# EAGLE design lightbar (EAGLE 5.04)
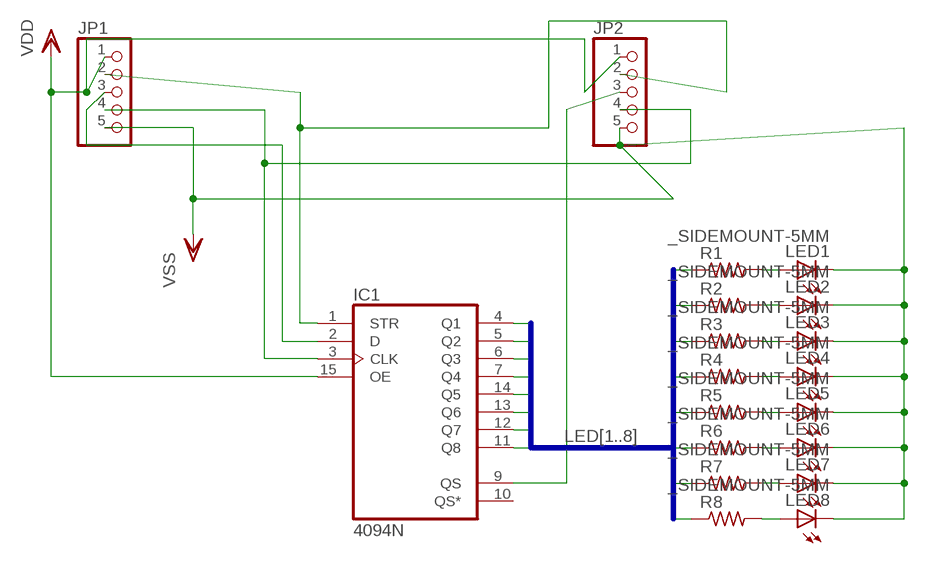
[diagram p0: schematic, sheet 1]

## Parts
IC1  4094N  [DIL16]
JP1  PINHD-1X5  [1X05]
JP2  PINHD-1X5  [1X05]
LED1  _SIDEMOUNT-5MM  [LED5MMSIDEMOUNT]
LED2  _SIDEMOUNT-5MM  [LED5MMSIDEMOUNT]
LED3  _SIDEMOUNT-5MM  [LED5MMSIDEMOUNT]
LED4  _SIDEMOUNT-5MM  [LED5MMSIDEMOUNT]
LED5  _SIDEMOUNT-5MM  [LED5MMSIDEMOUNT]
LED6  _SIDEMOUNT-5MM  [LED5MMSIDEMOUNT]
LED7  _SIDEMOUNT-5MM  [LED5MMSIDEMOUNT]
LED8  _SIDEMOUNT-5MM  [LED5MMSIDEMOUNT]
R1  R-US_0207/7  [0207/7]
R2  R-US_0207/7  [0207/7]
R3  R-US_0207/7  [0207/7]
R4  R-US_0207/7  [0207/7]
R5  R-US_0207/7  [0207/7]
R6  R-US_0207/7  [0207/7]
R7  R-US_0207/7  [0207/7]
R8  R-US_0207/7  [0207/7]

## Nets
LED1: IC1.4(Q1) R1.1
LED2: IC1.5(Q2) R2.1
LED3: IC1.6(Q3) R3.1
LED4: IC1.7(Q4) R4.1
LED5: IC1.14(Q5) R5.1
LED6: IC1.13(Q6) R6.1
LED7: IC1.12(Q7) R7.1
LED8: IC1.11(Q8) R8.1
N$1: IC1.2(D) JP1.3
N$2: IC1.9(QS) JP2.3
N$3: IC1.3(CLK) JP1.4 JP2.4
N$4: IC1.1(STR) JP1.2 JP2.2
N$8: LED1.A R1.2
N$9: LED2.A R2.2
N$10: LED3.A R3.2
N$11: LED4.A R4.2
N$12: LED5.A R5.2
N$13: LED6.A R6.2
N$14: LED7.A R7.2
N$15: LED8.A R8.2
VDD: IC1.15(OE) JP1.1
VSS: JP1.5 JP2.5 LED1.K(C) LED2.K(C) LED3.K(C) LED4.K(C) LED5.K(C) LED6.K(C) LED7.K(C) LED8.K(C)
Unconnected: IC1.10(QS*) JP2.1

## Buses
LED[1..8]

## Power pins joined to a net without a drawn wire
VDD: IC1.16(VDD)
VSS: IC1.8(VSS)

## Library data of the parts
IC1 = 40xx:4094: 8-stage SHIFT/STORE REGISTER, tri-state
JP1 JP2 = pinhead:PINHD-1X5: PIN HEADER
LED1-LED8 = led:_SIDEMOUNT-5MM
R1-R8 = resistor:R-US_: RESISTOR, American symbol

## Board
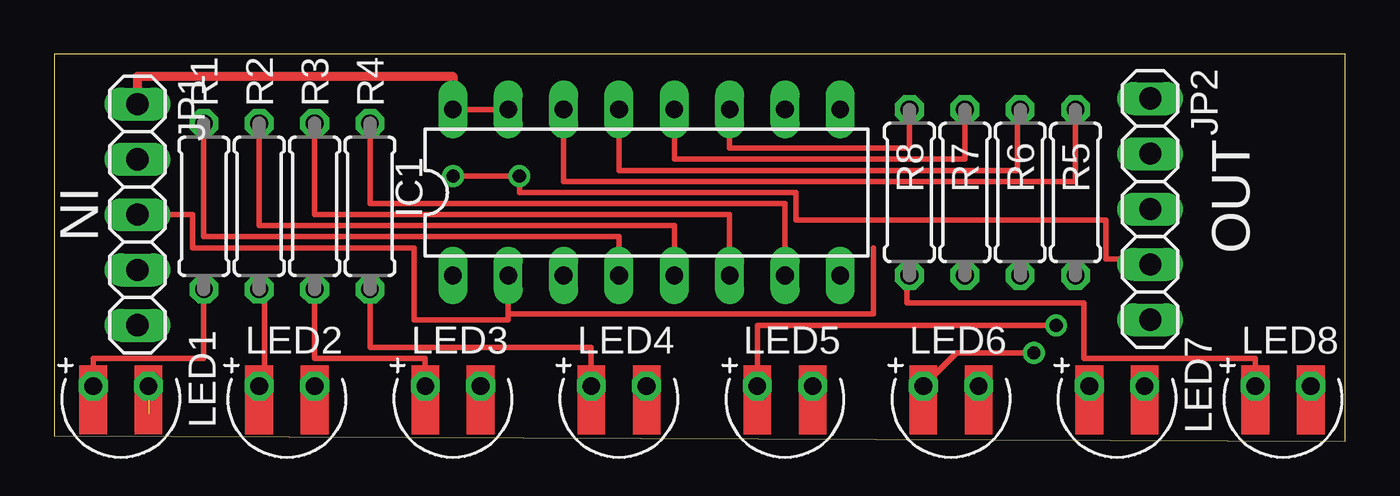
[diagram p1: board, top side]
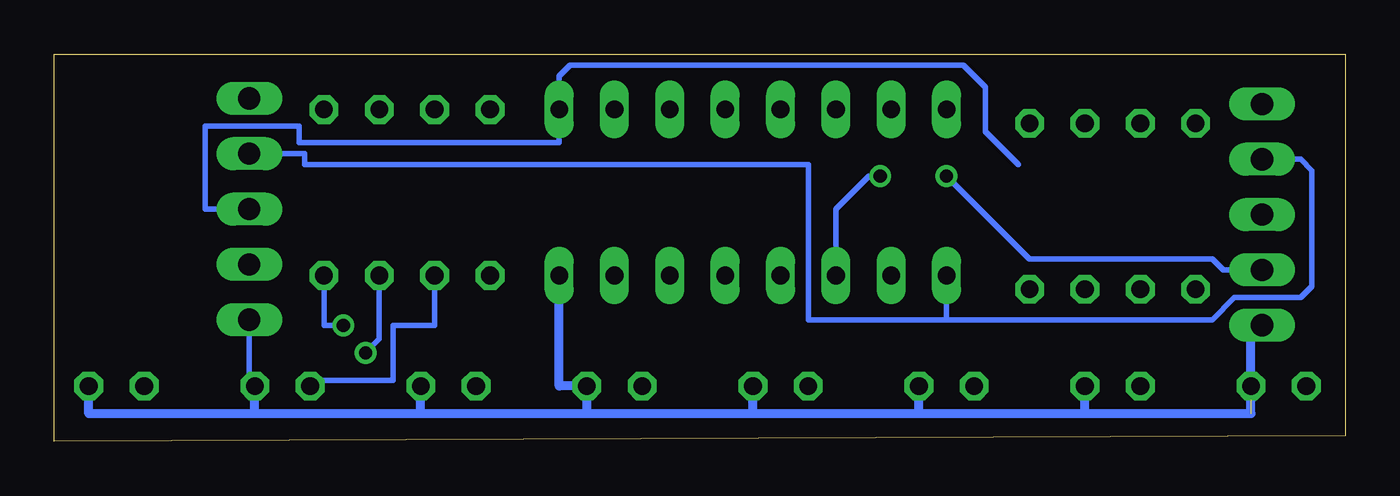
[diagram p2: board, bottom side, seen from below]

Size 59.23 x 17.77 mm. Coordinates in mm from the lower left corner, seen from the top.
Outline: 0,0.25 59.23,0 59.23,17.77 0,17.77 0,0.25
Copper layers (1*16): Top 0.035mm / dielectric 1.5mm / Bottom 0.035mm
Design rules "default *": minimum track width 10mil, minimum drill 24mil, track to track 8mil, track to pad 8mil, pad to pad 8mil, via to via 8mil, smd to smd 8mil, copper to edge 40mil, drill to drill 8mil, minimum pad ring 10mil, minimum via ring 8mil, stop-mask expansion 4mil, vias tented up to drill 24mil, thermal gap 10mil

### Footprints (pad centres in the part's own frame; a part is rotated, then mirrored left to right if it is on the bottom)
DIL16 = drill 0.813 long: 1 -8.89,-3.81; 2 -6.35,-3.81; 3 -3.81,-3.81; 4 -1.27,-3.81; 5 1.27,-3.81; 6 3.81,-3.81; 7 6.35,-3.81; 8 8.89,-3.81; 9 8.89,3.81; 10 6.35,3.81; 11 3.81,3.81; 12 1.27,3.81; 13 -1.27,3.81; 14 -3.81,3.81; 15 -6.35,3.81; 16 -8.89,3.81
1X05 = drill 1.016 long: 1 -5.08,0; 2 -2.54,0; 3 0,0; 4 2.54,0; 5 5.08,0
LED5MMSIDEMOUNT = drill 0.813 octagon: A -1.27,0; K 1.27,0
0207/7 = drill 0.813 octagon: 1 -3.81,0; 2 3.81,0

### Placement (x,y rotation side)
IC1  27.18,11.43 0 top
JP1  3.81,10.41 270 top
JP2  50.29,10.67 270 top
LED1  3.05,2.54 0 top
LED2  10.67,2.54 0 top
LED3  18.29,2.54 0 top
LED4  25.91,2.54 0 top
LED5  33.53,2.54 0 top
LED6  41.15,2.54 0 top
LED7  48.77,2.54 0 top
LED8  56.39,2.54 0 top
R1  6.86,10.79 270 top
R2  9.4,10.79 270 top
R3  11.94,10.79 270 top
R4  14.48,10.79 270 top
R5  46.86,11.43 270 top
R6  44.32,11.43 270 top
R7  41.78,11.43 270 top
R8  39.24,11.43 270 top

### Tracks (layer width: path | path; a pad name or v marks a point on that pad's centre or on a via)
LED1
  Top 0.254: R1.1 6.86,9.4 25.91,9.4 IC1.4
LED2
  Top 0.254: R2.1 9.4,9.91 28.45,9.91 IC1.5
LED3
  Top 0.254: R3.1 11.94,10.41 30.99,10.41 IC1.6
LED4
  Top 0.254: IC1.7 33.53,10.92 14.48,10.92 R4.1
LED5
  Top 0.254: R5.1 46.86,11.94 23.37,11.94 IC1.14
LED6
  Top 0.254: IC1.13 25.91,12.45 44.2,12.45 44.2,15.24 R6.1
LED7
  Top 0.254: R7.1 41.78,12.95 28.45,12.95 IC1.12
LED8
  Top 0.254: R8.1 39.24,13.46 30.99,13.46 IC1.11
N$1
  Top 0.254: 37.59,8.89 37.59,5.84 20.83,5.84 | 20.83,5.84 IC1.2 | JP1.3 6.35,10.41 6.35,8.89 16.51,8.89 16.51,5.59 20.83,5.59 20.83,5.84
N$2
  Bottom 0.254: 14.99,12.7 16.51,14.22 16.51,16.26 17.53,17.27 35.56,17.27 36.07,16.76 IC1.9 36.07,13.72 48.01,13.72 48.01,14.48 52.32,14.48 52.32,10.67 JP2.3
N$3  (via drill 0.6)
  Top 0.254: v18.29,12.19 v21.34,12.19 21.34,11.43 34.04,11.43 34.04,10.16 48.26,10.16 48.26,8.38 50.29,8.38 JP2.4
  Bottom 0.254: 16.64,10.54 16.26,10.16 | 16.64,10.54 v18.29,12.19 | v21.34,12.19 21.84,12.19 23.37,10.67 IC1.3 | JP1.4 5.59,7.87 6.1,8.38 14.48,8.38 16.64,10.54
N$4
  Bottom 0.254: 18.29,5.59 6.1,5.59 5.08,6.6 2.03,6.6 1.52,7.11 1.52,12.45 2.03,12.95 JP1.2 | 18.29,5.59 24.64,5.59 24.64,12.7 47.75,12.7 47.75,13.21 JP2.2 | 18.29,5.59 IC1.1
N$8
  Top 0.254: LED1.A 1.78,3.81 6.86,3.81 R1.2
N$9
  Top 0.254: LED2.A 9.65,2.54 9.65,6.99 R2.2
N$10
  Top 0.254: R3.2 11.94,3.81 17.02,3.81 LED3.A
N$11
  Top 0.254: LED4.A 24.64,4.32 14.48,4.32 R4.2
N$12  (via drill 0.6)
  Top 0.254: LED5.A 32.26,5.33 v45.97,5.33
  Bottom 0.254: v45.97,5.33 46.86,5.33 R5.2
N$13  (via drill 0.6)
  Top 0.254: LED6.A 41.4,4.06 v44.96,4.06
  Bottom 0.254: v44.96,4.06 44.32,4.7 R6.2
N$14
  Bottom 0.254: LED7.A 47.5,2.79 43.69,2.79 43.69,5.33 41.78,5.33 R7.2
N$15
  Top 0.254: LED8.A 55.12,3.81 47.24,3.81 47.24,6.35 39.12,6.35 39.12,7.62 R8.2
VDD
  Top 0.254: IC1.16 IC1.15
  Top 0.406: IC1.16 18.29,16.76 3.81,16.76 JP1.1
VSS  (1 unrouted)
  Bottom 0.254: JP1.5 4.32,5.33 4.32,5.08 | LED7.K 50.29,2.54 JP2.5
  Bottom 0.406: 11.94,1.27 4.32,1.27 4.32,5.08 | 19.56,1.27 27.18,1.27 | 27.18,1.27 34.8,1.27 | 34.8,1.27 42.42,1.27 | 50.04,1.27 57.66,1.27 LED8.K | 4.32,1.91 LED1.K | 11.94,1.27 LED2.K | 11.94,1.27 19.56,1.27 | 19.56,1.27 LED3.K | 27.18,1.27 LED4.K | 34.8,1.27 LED5.K 36.07,2.54 IC1.8 | 42.42,1.27 LED6.K | 42.42,1.27 50.04,1.27 | 50.04,1.27 LED7.K

### Text on the board
tNames: IN | OUT
SILKSCREEN_TBA: thrix-tape | zbanks 081609 | olopede industries | olopede.com/thrix